# Altium project CorrosenseBoard_V4.2.PrjPcb (part 2 of 2)
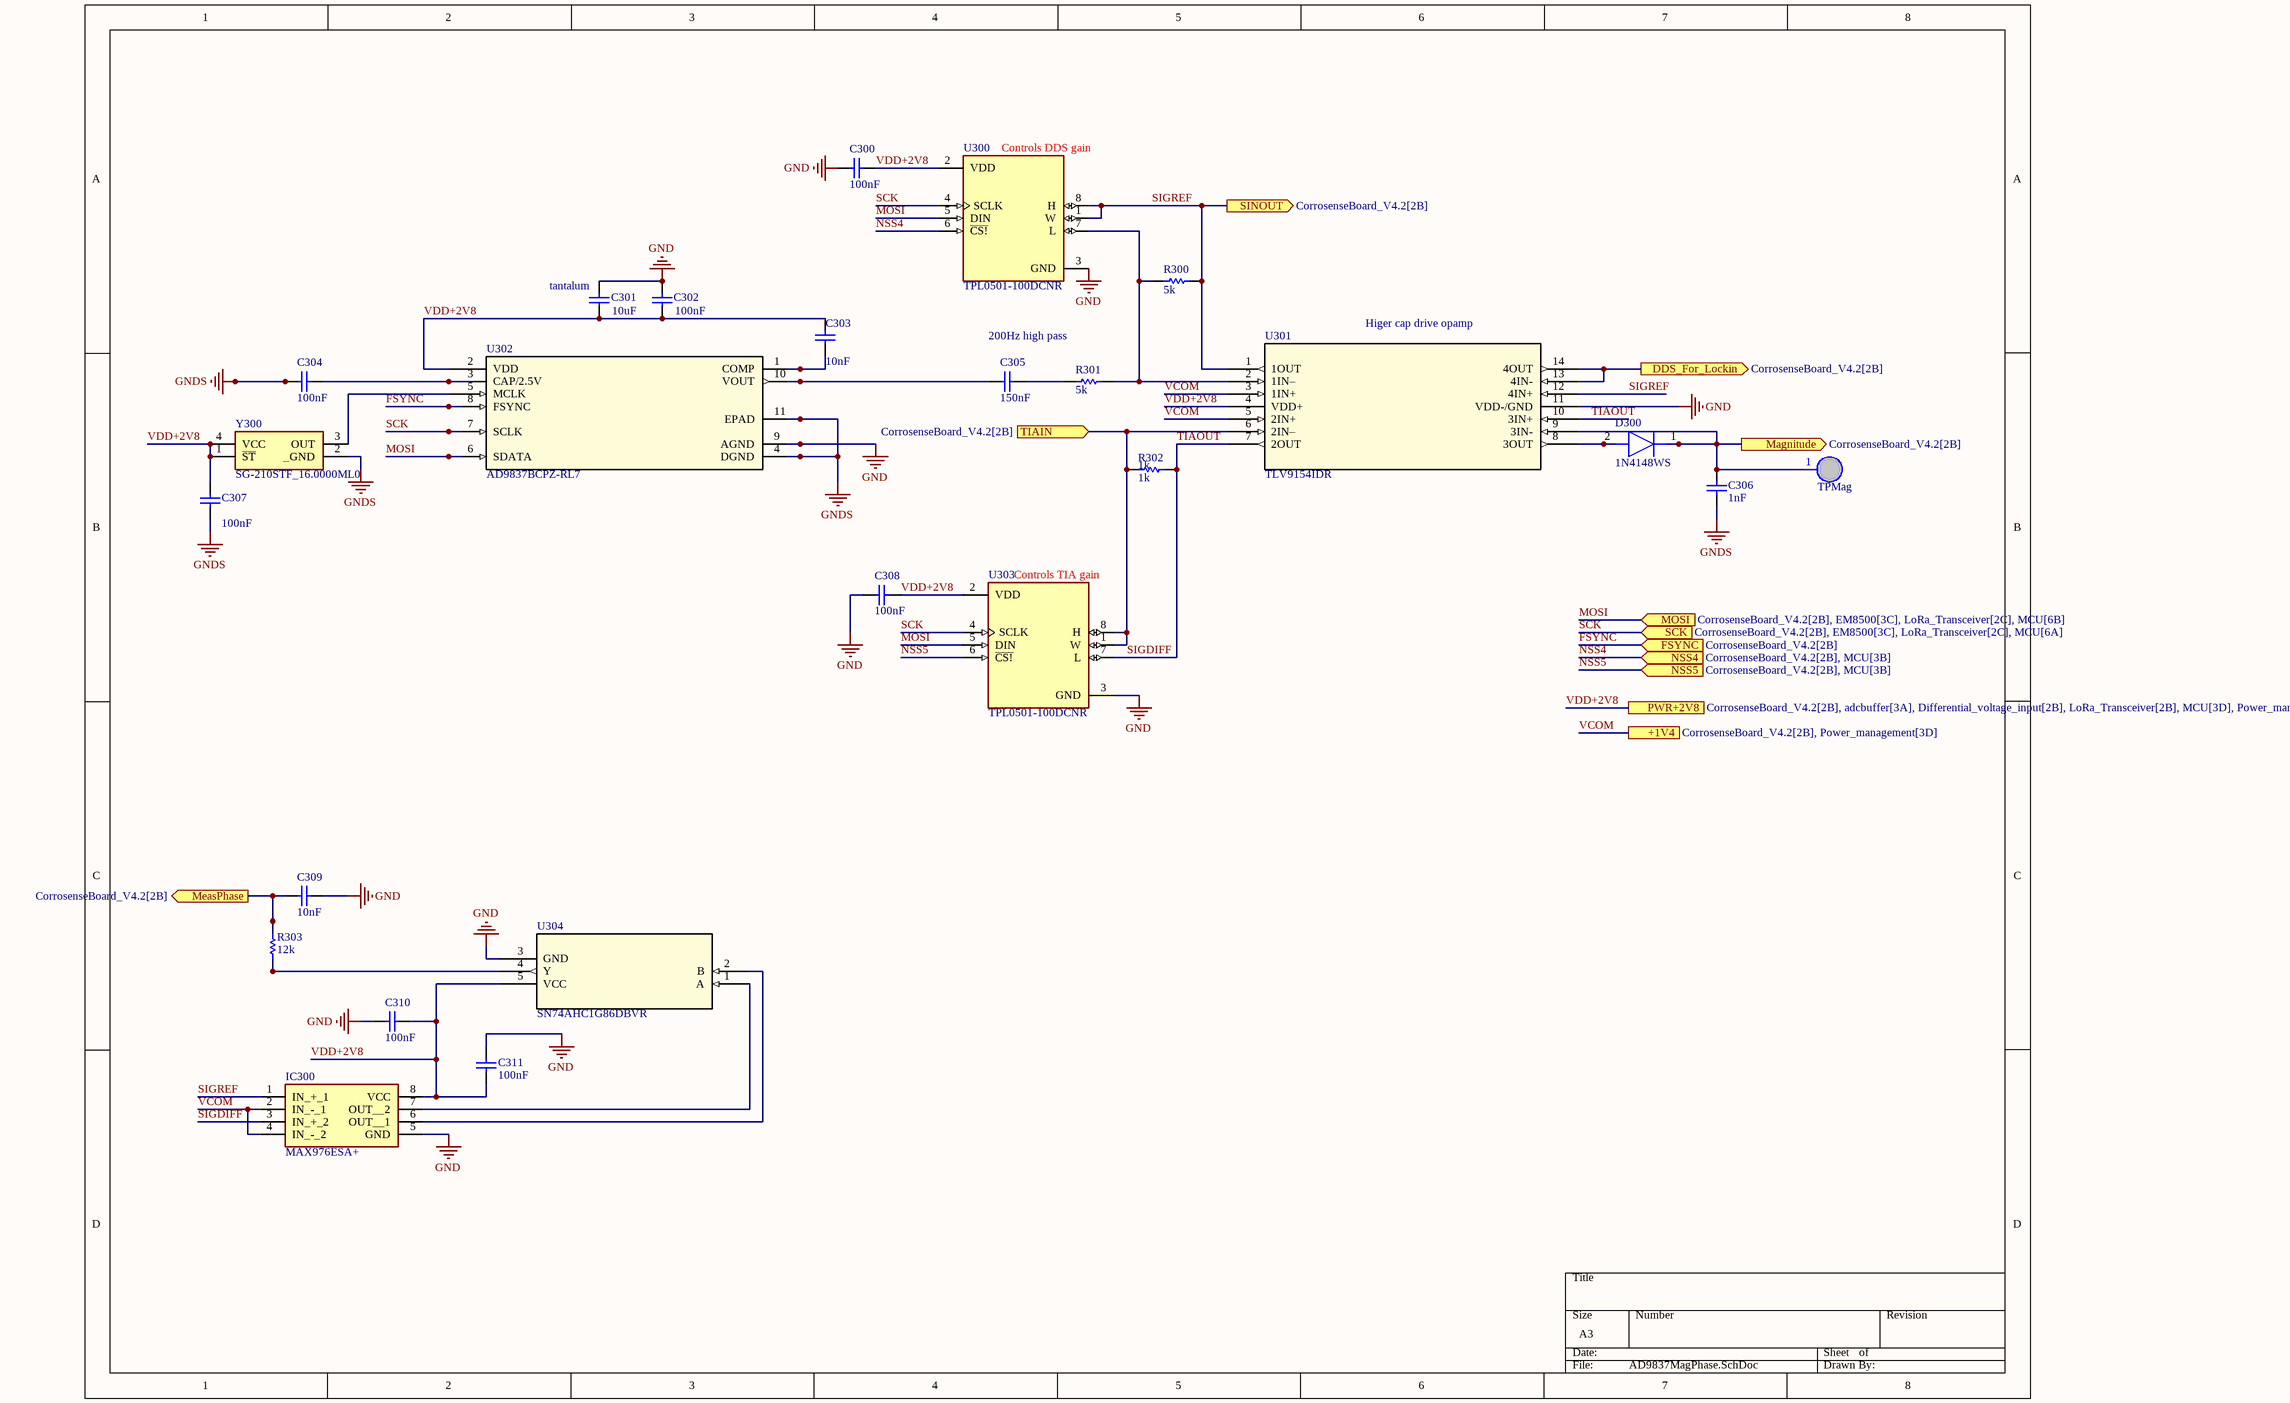
[diagram p8: AD9837MagPhase.SchDoc]

## Nets that join several sheets
GND: CorrosenseBoard_V4.2 (9 pins), adcbuffer (10 pins), Differential_voltage_input (6 pins), MCU (6 pins), AD9837MagPhase (13 pins)
GNDS: CorrosenseBoard_V4.2 (11 pins), adcbuffer (C702.2 U702.1 U702.3), EM8500 (11 pins), MCU (62 pins), LoRa_Transceiver (9 pins), Power_management (13 pins), AD9837MagPhase (6 pins)
ADC_RDY: adcbuffer (U702.2), MCU (U200.46)
ALTPS: EM8500 (C500.2 P500.2), LoRa_Transceiver (P800.3)
CLKH: CorrosenseBoard_V4.2 (FROM100.10), MCU (U200.67)
D+: CorrosenseBoard_V4.2 (J100.3), MCU (U201.4)
D-: CorrosenseBoard_V4.2 (J100.2), MCU (U201.5)
DDS_For_Lockin: CorrosenseBoard_V4.2 (P101.9), AD9837MagPhase (U301.13 U301.14)
DIO0: MCU (U200.71), LoRa_Transceiver (IC800.14)
DIO1: MCU (U200.70), LoRa_Transceiver (IC800.15)
FSYNC: MCU (U200.51), AD9837MagPhase (U302.8)
I2C3_SCL: CorrosenseBoard_V4.2 (P103.3 R100.1), adcbuffer (U702.10), MCU (U200.32)
I2C3_SDA: CorrosenseBoard_V4.2 (P103.4 R101.1), adcbuffer (U702.9), MCU (U200.90)
IN5: adcbuffer (R713.2), Differential_voltage_input (C603.1 R601.2)
IN6: adcbuffer (R712.2), Power_management (C405.2 R400.1 R402.2)
MeasMag: CorrosenseBoard_V4.2 (TO100.2), adcbuffer (U700.3), AD9837MagPhase (C306.1 D300.1 TPMag.1 U301.9)
MeasPhase: CorrosenseBoard_V4.2 (TO100.4), adcbuffer (U700.10), AD9837MagPhase (C309.1 R303.2)
MeasX: CorrosenseBoard_V4.2 (P101.6 TO100.6), adcbuffer (R701.2)
MeasY: CorrosenseBoard_V4.2 (P101.5 TO100.8), adcbuffer (R710.2)
MISO: CorrosenseBoard_V4.2 (P100.3), EM8500 (IC500.5), MCU (U200.53), LoRa_Transceiver (IC800.2)
MOSI: CorrosenseBoard_V4.2 (P100.1 P101.3), EM8500 (IC500.4), MCU (U200.54), LoRa_Transceiver (IC800.3), AD9837MagPhase (U300.5 U302.6 U303.5)
NetC504_1: EM8500 (C504.1 IC500.16), Power_management (P402.1)
NetC505_2: EM8500 (C505.2 IC500.12), Power_management (P400.1)
NetIC500_7: EM8500 (IC500.7), MCU (U200.95)
NetIC500_17: EM8500 (IC500.17), MCU (U200.89)
NetIC500_18: EM8500 (IC500.18), MCU (U200.96)
NetJ101_1: CorrosenseBoard_V4.2 (J101.1), MCU (U200.6), Power_management (P401.1 R400.2)
NetP102_1: CorrosenseBoard_V4.2 (P102.1), MCU (U200.4)
NetP102_2: CorrosenseBoard_V4.2 (P102.2), MCU (U200.3)
NetP102_3: CorrosenseBoard_V4.2 (P102.3), MCU (U200.2)
NetP102_4: CorrosenseBoard_V4.2 (P102.4), MCU (U200.1)
NetP102_5: CorrosenseBoard_V4.2 (P102.5), MCU (U200.98)
NetU200_23: adcbuffer (U701.1 U701.2), MCU (U200.23)
NetU200_24: adcbuffer (U701.6 U701.7), MCU (U200.24)
NetU200_25: adcbuffer (U701.8 U701.9), MCU (U200.25)
NSS1: MCU (U200.69), LoRa_Transceiver (IC800.5)
NSS4: MCU (U200.62), AD9837MagPhase (U300.6)
NSS5: MCU (U200.61), AD9837MagPhase (U303.6)
NSS6: CorrosenseBoard_V4.2 (P101.1), MCU (U200.48)
PWR+2V8: CorrosenseBoard_V4.2 (6 pins), adcbuffer (11 pins), Differential_voltage_input (C600.1 U600.8), MCU (FB200.2), LoRa_Transceiver (P800.1), Power_management (P402.2), AD9837MagPhase (16 pins)
PWR+DC: CorrosenseBoard_V4.2 (P101.10), Power_management (P400.2)
RESET: MCU (U200.68), LoRa_Transceiver (IC800.6)
SCK: CorrosenseBoard_V4.2 (P100.2 P101.2), EM8500 (IC500.6), MCU (U200.52), LoRa_Transceiver (IC800.4), AD9837MagPhase (U300.4 U302.7 U303.4)
SIGREF: CorrosenseBoard_V4.2 (P105.1 P107.1), AD9837MagPhase (6 pins)
SPIKN1_H: CorrosenseBoard_V4.2 (FROM100.2), MCU (U200.82)
SPIKN2_H: CorrosenseBoard_V4.2 (FROM100.7), MCU (U200.86)
SPIKN3_H: CorrosenseBoard_V4.2 (FROM100.9), MCU (U200.88)
SPIKN4_H: CorrosenseBoard_V4.2 (FROM100.4), MCU (U200.84)
SPIKP1_H: CorrosenseBoard_V4.2 (FROM100.1), MCU (U200.81)
SPIKP2_H: CorrosenseBoard_V4.2 (FROM100.6), MCU (U200.85)
SPIKP3_H: CorrosenseBoard_V4.2 (FROM100.8), MCU (U200.87)
SPIKP4_H: CorrosenseBoard_V4.2 (FROM100.3), MCU (U200.83)
TIAIN: CorrosenseBoard_V4.2 (P106.1), AD9837MagPhase (R302.2 U301.6 U303.1 U303.8)
Uin(+): CorrosenseBoard_V4.2 (P109.2), Differential_voltage_input (R603.1)
Uin(-): CorrosenseBoard_V4.2 (P109.1), Differential_voltage_input (R600.1)
VBUS: CorrosenseBoard_V4.2 (J100.1), EM8500 (P501.2), MCU (C206.2 C207.2 U201.7 U201.8), Power_management (P401.3)
VCOM: Power_management (C407.1 IC401.5 R401.2), AD9837MagPhase (IC300.2 IC300.4 U301.3 U301.5)
VDD_HRV: CorrosenseBoard_V4.2 (P108.1), EM8500 (C502.2 IC500.23 L500.1)
VinADC: CorrosenseBoard_V4.2 (P107.2), adcbuffer (R704.2)
WKUP2: CorrosenseBoard_V4.2 (R102.2), MCU (R201.1)